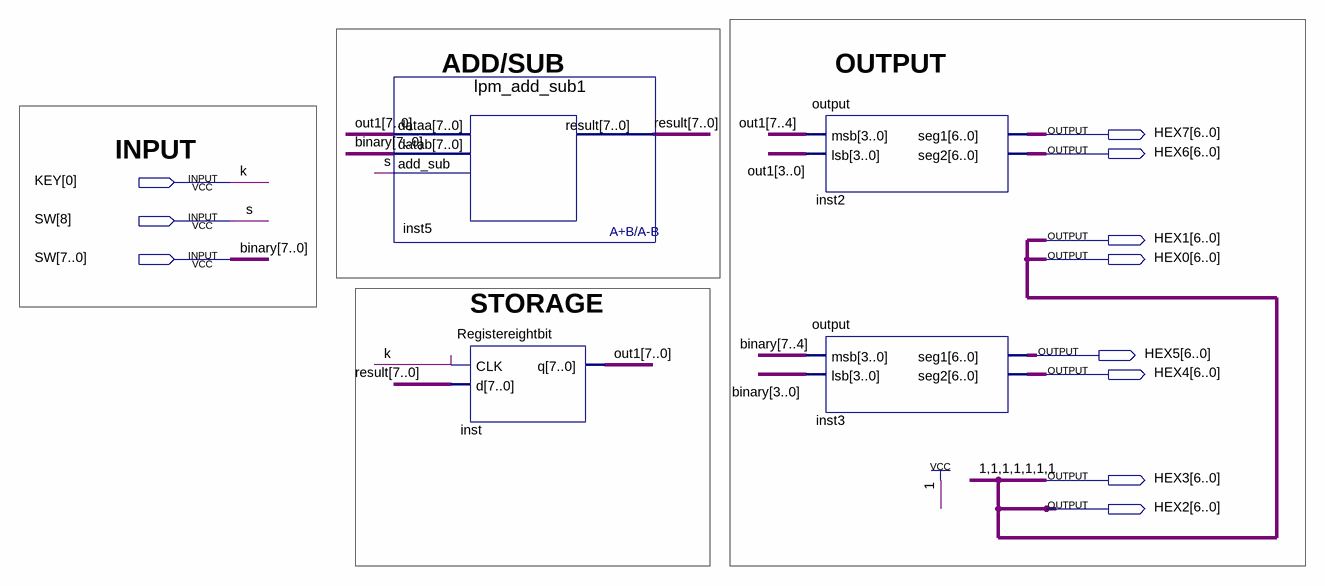
[diagram p0: schematic sheet]
// Quartus schematic Lab5.bdf as structural Verilog: 4 symbols, 11 pins
module Lab5 (
  input  [0:0] KEY,
  input  [8:0] SW,
  output [6:0] HEX7,
  output [6:0] HEX6,
  output [6:0] HEX1,
  output [6:0] HEX0,
  output [6:0] HEX5,
  output [6:0] HEX4,
  output [6:0] HEX3,
  output [6:0] HEX2
);

  wire [7:0] out1, result;

  lpm_add_sub1 inst5 (.dataa(out1), .datab(SW[7:0]), .add_sub(SW[8]), .result(result));
  Registereightbit inst (.CLK(KEY[0]), .d(result), .q(out1));
  \output  inst2 (.msb(out1[7:4]), .lsb(out1[3:0]), .seg1(HEX7), .seg2(HEX6));
  \output  inst3 (.msb(SW[7:4]), .lsb(SW[3:0]), .seg1(HEX5), .seg2(HEX4));

  assign HEX0 = {7{1'b1}};
  assign HEX1 = {7{1'b1}};
  assign HEX2 = {7{1'b1}};
  assign HEX3 = {7{1'b1}};

  // Other names for the same wires on the sheet: binary[7:0] = SW[7:0]; k = KEY[0]; s = SW[8]

  // Notes on the sheet:
  //   ADD/SUB
  //   OUTPUT
  //   INPUT
  //   STORAGE
endmodule
